# EAGLE schematic interface board (EAGLE 7.6.0)
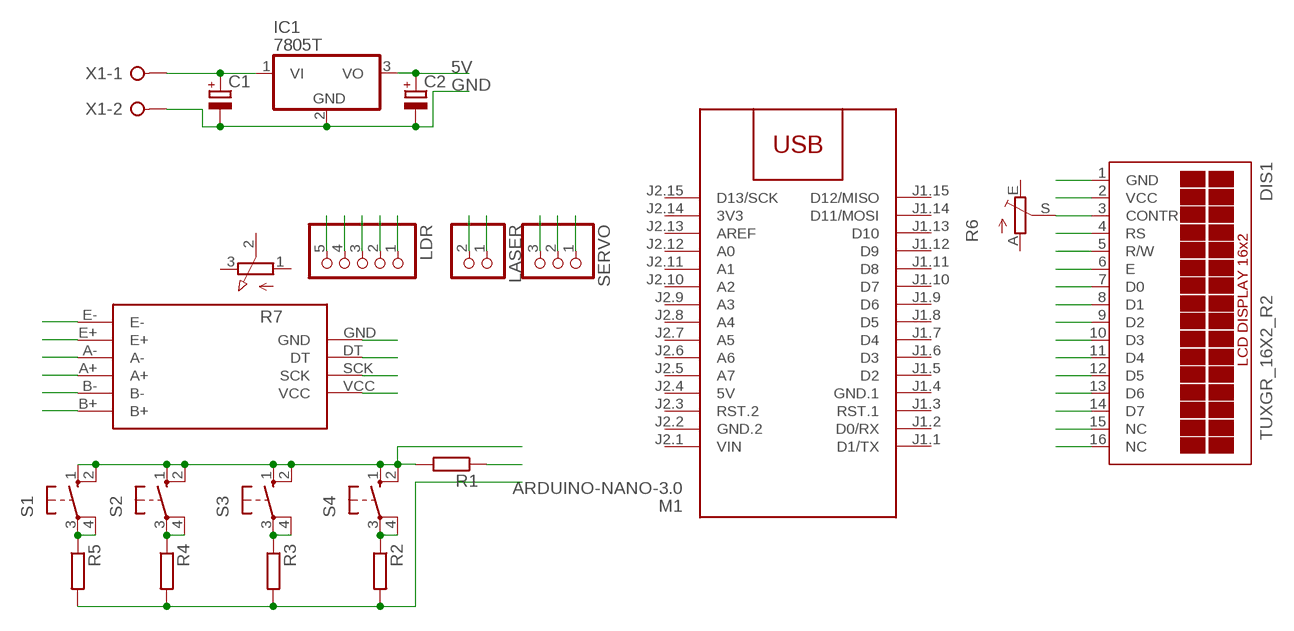
[diagram p0: schematic, sheet 1]

## Parts
C1  CPOL-EUE2.5-7  [E2,5-7]
C2  CPOL-EUE2.5-7  [E2,5-7]
DIS1  TUXGR_16X2_R2  [TUXGR_16X2_R2]
IC1  7805T  [TO220H]
LASER  PINHD-1X2  [1X02]
LDR  PINHD-1X5  [1X05]
M1  ARDUINO-NANO-3.0  [ARDUINO-NANO-3.0]
R1  R-EU_0207/10  [0207/10]
R2  R-EU_0207/10  [0207/10]
R3  R-EU_0207/10  [0207/10]
R4  R-EU_0207/10  [0207/10]
R5  R-EU_0207/10  [0207/10]
R6  TRIM_EU-B25P  [B25P]
R7  3RP/1610N  [3RP/1610N]
S1  40-XX  [B3F-40XX]
S2  40-XX  [B3F-40XX]
S3  40-XX  [B3F-40XX]
S4  40-XX  [B3F-40XX]
SERVO  PINHD-1X3  [1X03]
U$2  HX711  [HX711]
X1  W237-02P  [W237-132]

## Nets
5V: C2.+ IC1.3(VO)
GND: C1.- C2.- IC1.2(GND) X1.2
N$1: DIS1.1(GND)
N$2: DIS1.2(VCC)
N$3: DIS1.3(CONTR) R6.S
N$4: DIS1.4(RS)
N$5: DIS1.5(R/W)
N$6: DIS1.7(D0)
N$7: DIS1.8(D1)
N$8: DIS1.9(D2)
N$9: DIS1.10(D3)
N$10: DIS1.11(D4)
N$11: DIS1.12(D5)
N$12: DIS1.13(D6)
N$13: DIS1.14(D7)
N$14: DIS1.15(NC)
N$15: DIS1.16(NC)
N$16: DIS1.6(E)
N$17: R2.1 S4.3(P) S4.4(P1)
N$18: R3.1 S3.3(P) S3.4(P1)
N$19: R4.1 S2.3(P) S2.4(P1)
N$20: R5.1 S1.3(P) S1.4(P1)
N$21: C1.+ IC1.1(VI) X1.1
N$24: LDR.3
N$25: R1.2 S1.1(S) S1.2(S1) S2.1(S) S2.2(S1) S3.1(S) S3.2(S1) S4.1(S) S4.2(S1)
N$26: R2.2 R3.2 R4.2 R5.2
N$27: R1.1
N$28: LDR.5
N$29: LDR.4
N$30: LDR.2
N$31: LDR.1
N$32: LASER.2
N$33: LASER.1
N$34: SERVO.3
N$35: SERVO.2
N$36: SERVO.1
N$37: U$2.GND
N$38: U$2.DT
N$39: U$2.SCK
N$40: U$2.VCC
N$41: U$2.E-
N$42: U$2.E+
N$43: U$2.A-
N$44: U$2.A+
N$45: U$2.B-
N$46: U$2.B+
Unconnected: M1.J1.1(D1/TX) M1.J1.2(D0/RX) M1.J1.3(RST.1) M1.J1.5(D2) M1.J1.6(D3) M1.J1.7(D4) M1.J1.8(D5) M1.J1.9(D6) M1.J1.10(D7) M1.J1.11(D8) M1.J1.12(D9) M1.J1.13(D10) M1.J1.14(D11/MOSI) M1.J1.15(D12/MISO) M1.J2.3(RST.2) M1.J2.5(A7) M1.J2.6(A6) M1.J2.7(A5) M1.J2.8(A4) M1.J2.9(A3) M1.J2.10(A2) M1.J2.11(A1) M1.J2.12(A0) M1.J2.13(AREF) M1.J2.15(D13/SCK) R6.A R6.E R7.1(A) R7.2(S) R7.3(E)

## Power pins joined to a net without a drawn wire
3V3: M1.J2.14(3V3)
5V: M1.J2.4(5V)
GND.1: M1.J1.4(GND.1)
GND.2: M1.J2.2(GND.2)
VIN: M1.J2.1(VIN)

## Library data of the parts
C1 C2 = rcl:CPOL-EU: POLARIZED CAPACITOR, European symbol
DIS1 = display-lcd:TUXGR_16X2_R2: Tuxgraphics LCD display 16x2 characters reflective, without background light Source: tuxgr_12x2_r2.pdf; OC_FARNELL: unknown; OC_NEWARK: unknown
IC1 = linear:78*: Positive VOLTAGE REGULATOR Source: http://cache.national.com/ds/LM/LM78L05.pdf http://www.fairchildsemi.com/ds/LM/LM7805.pdf
LASER = pinhead:PINHD-1X2: PIN HEADER
LDR = pinhead:PINHD-1X5: PIN HEADER
M1 = diy-modules:ARDUINO-NANO-3.0: Arduino Nano 3.0 and compatible devices More details available here: https://www.arduino.cc/en/Main/ArduinoBoardNano Click here to find device on ebay.com <http://www.ebay.com/sch/arduino+nano>
R1-R5 = rcl:R-EU_: RESISTOR, European symbol
R6 = pot:TRIM_EU-: POTENTIOMETER
R7 = pot:3RP/1610N: 16mm Potentiometer one level Source: http://www.alphapotentiometers.net/html/16mm_pot_2.html
S1-S4 = switch-omron:40-XX: OMRON SWITCH; MF: OMRON COMPONENTS USA; MPN: B3F-4000; OC_FARNELL: 176434; OC_NEWARK: 36K3105
SERVO = pinhead:PINHD-1X3: PIN HEADER
U$2 = HX711:HX711
X1 = con-wago-508:W237-02P: WAGO SREW CLAMP; OC_FARNELL: unknown; OC_NEWARK: unknown